# Altium project HLib-Comm-RS485.PrjPcb
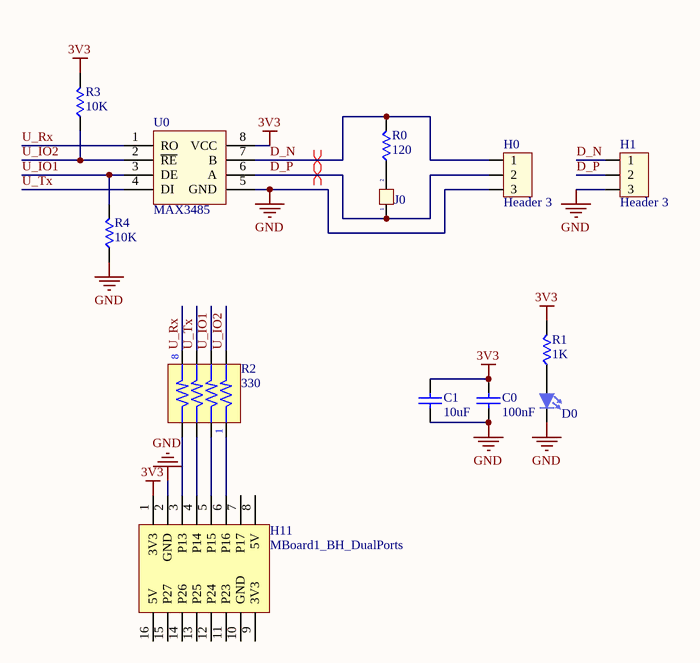
[diagram p0: HLib-Comm-RS485.SchDoc]
1 sheet, 13 parts. Net scope: hierarchical (ports join the sheet entries above them; power ports are global).
Board file: PCB1.PcbDoc

## Sheet HLib-Comm-RS485.SchDoc
size A

### Parts
C0  value 100nF  [SM_0805_C_CERAMIC]  (hidden comment: C_Ceramic)
C1  value 10uF  [SM_0805_C_CERAMIC]  (hidden comment: C_Ceramic)
D0  LED  [SM_0805_LED]  (value not drawn)
H0  Header 3  [TerminalBlock_3_5mm]
H1  Header 3  [Hed3]
H11  MBoard1_BH_DualPorts  [MBoard1_BH_DualPorts]
J0  Jumper 2  [J2]  (value not drawn)
R0  value 120  [SM_0805_R]  (hidden comment: R)
R1  value 1K  [SM_0805_R]  (hidden comment: R)
R2  330  [RA4]
R3  value 10K  [SM_0805_R]  (hidden comment: R)
R4  value 10K  [SM_0805_R]  (hidden comment: R)
U0  MAX3485  [SO-8]

### Nets
3V3: C0.2 C1.2 H11.1(3V3) R1.2 R3.2 U0.8(VCC)
GND: C0.1 C1.1 D0.2(K) H0.3 H1.3 H11.2(GND) R4.1 U0.5(GND)
D_N: H0.1 H1.1 R0.2 U0.7(B)
D_P: H0.2 H1.2 J0.1 U0.6(A)
U_IO1: R2.4 R4.2 U0.3(DE)
U_IO2: R2.2 R3.1 U0.2(~{RE})
U_Rx: R2.8 U0.1(RO)
U_Tx: R2.6 U0.4(DI)
NetD0_1: D0.1(A) R1.1
NetH11_3: H11.3(P13) R2.7
NetH11_4: H11.4(P14) R2.5
NetH11_5: H11.5(P15) R2.3
NetH11_6: H11.6(P16) R2.1
NetJ0_2: J0.2 R0.1

Not connected (* = marked no-connect by the designer): H11 7(P17) 8(5V) 9(3V3) 10(GND) 11(P23) 12(P24) 13(P25) 14(P26) 15(P27) 16(5V)

### Layout directives
differential pair: D_N, D_P

### Library data of the parts
C0 C1 = C_Ceramic: Non-polarity ceramic capacitor; Published: 8-Jun-2000; LatestRevisionDate: 17-Jul-2002; LatestRevisionNote: Re-released for DXP Platform.; PackageReference: RAD-0.3; Publisher: Altium Limited; PackageDescription: Radial Cap, Thru-Hole; 2 Leads; 0.3 in Pin Spacing
H0 H1 = Hed3: Header 3 (Green); Value: Header 3
J0 = JP 2: Value: JP 2
R0 R1 R3 R4 = R: Resistor; Published: 8-Jun-2000; LatestRevisionDate: 29-May-2009; LatestRevisionNote: IPC-7351 Footprint Added.; PackageReference: J1-0603; Publisher: Altium Limited; PackageDescription: Chip Resistor
R2 = RA4
U0 = MAX485: RS232 - RS485 (Same sn75176)
D0 = LED: Published: 8-Jun-2000; LatestRevisionDate: 08-Jul-2005; LatestRevisionNote: Mech Layer 1 removed.; PackageReference: LED-1; Publisher: Altium Limited; PackageDescription: LED; 2 Leads